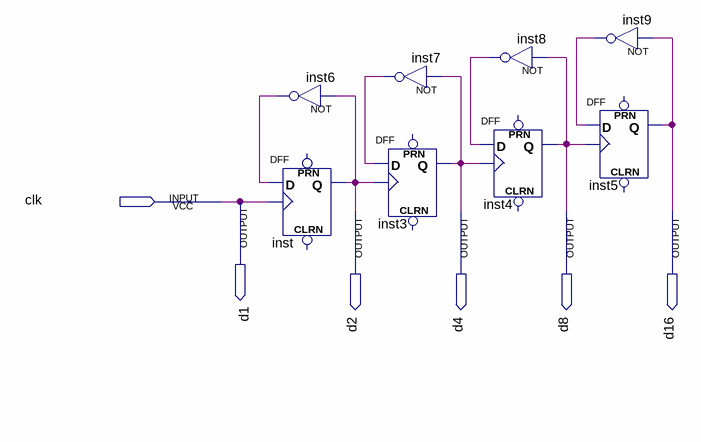
[diagram p0: schematic sheet]
// Quartus schematic dtypeff.bdf as structural Verilog: 8 symbols, 6 pins
module dtypeff (
  input  clk,
  output d1,
  output d2,
  output d4,
  output d8,
  output d16
);

  wire inst6_out, inst7_out, inst8_out, inst9_out;

  DFF inst (.CLK(clk), .D(inst6_out), .Q(d2));  // open: CLRN, PRN
  not inst6 (inst6_out, d2);
  not inst7 (inst7_out, d4);
  DFF inst3 (.CLK(d2), .D(inst7_out), .Q(d4));  // open: CLRN, PRN
  not inst8 (inst8_out, d8);
  DFF inst4 (.CLK(d4), .D(inst8_out), .Q(d8));  // open: CLRN, PRN
  not inst9 (inst9_out, d16);
  DFF inst5 (.CLK(d8), .D(inst9_out), .Q(d16));  // open: CLRN, PRN

  assign d1 = clk;
endmodule
